# EAGLE design 89c2051-amiga1000-ps2 (EAGLE 4.16)
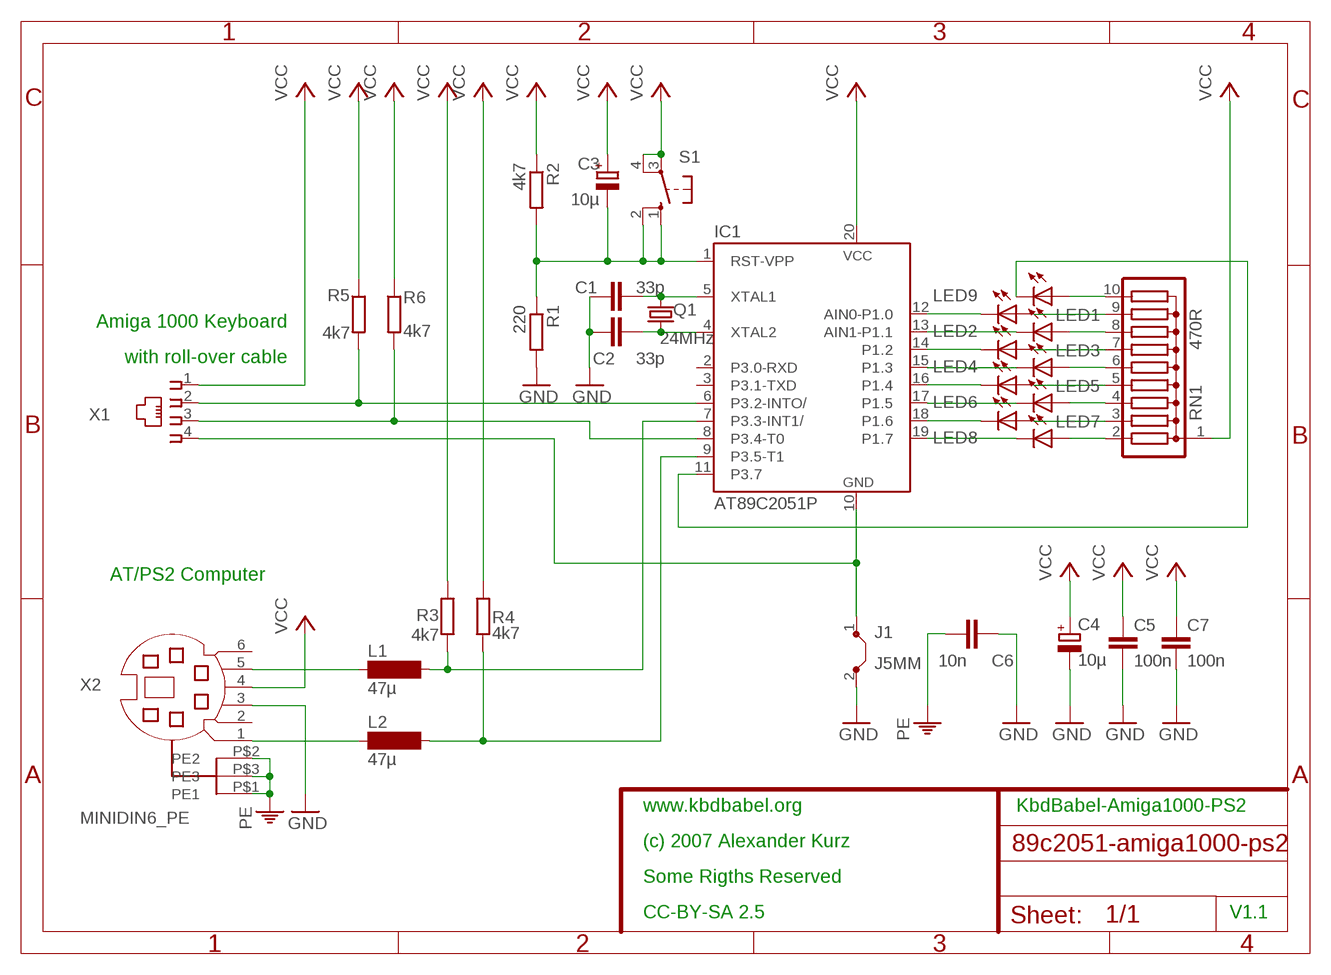
[diagram p0: schematic, sheet 1]

## Parts
C1  33p  C-EU025-030X050  [C025-030X050]
C2  33p  C-EU025-030X050  [C025-030X050]
C3  10µ  CPOL-EUE2-5  [E2-5]
C4  10µ  CPOL-EUE2-5  [E2-5]
C5  100n  C-EU025_050-025X075  [C025_050-025X075]
C6  10n  C-EU025_050-025X075  [C025_050-025X075]
C7  100n  C-EU025_050-025X075  [C025_050-025X075]
IC1  AT89C2051P  [DIL20]
J1  J5MM  [05]
L1  47µ  SD75  [SD75]
L2  47µ  SD75  [SD75]
LED1  LEDSQR2X5  [LED2X5]
LED2  LEDSQR2X5  [LED2X5]
LED3  LEDSQR2X5  [LED2X5]
LED4  LEDSQR2X5  [LED2X5]
LED5  LEDSQR2X5  [LED2X5]
LED6  LEDSQR2X5  [LED2X5]
LED7  LEDSQR2X5  [LED2X5]
LED8  LEDSQR2X5  [LED2X5]
LED9  LEDSQR2X5  [LED2X5]
Q1  24MHz  CRYSTALHC49U70  [HC49U70]
R1  220  R-EU_0204/7  [0204/7]
R2  4k7  R-EU_0204/7  [0204/7]
R3  4k7  R-EU_0204/7  [0204/7]
R4  4k7  R-EU_0204/7  [0204/7]
R5  4k7  R-EU_0204/7  [0204/7]
R6  4k7  R-EU_0204/7  [0204/7]
RN1  470R  G09R  [SIL10]
S1  10-XX  [B3F-10XX]
X1  520249-2  [520249-2]
X2  MINIDIN6_PE  [MINIDIN6_PE]

## Nets
GND: C1.1 C2.2 C4.- C5.1 C6.1 C7.1 J1.2 R1.2 X2.3
N$1: C1.2 IC1.5(XTAL1) Q1.2
N$2: C2.1 IC1.4(XTAL2) Q1.1
N$4: LED1.A RN1.9
N$5: IC1.17(P1.5) LED6.K(C)
N$6: L1.1 X2.5
N$7: IC1.6(P3.2-INTO/) R5.2 X1.2
N$8: IC1.12(AIN0-P1.0) LED1.K(C)
N$9: C3.- IC1.1(RST-VPP) R1.1 R2.2 S1.1(S) S1.2(S1)
N$10: IC1.8(P3.4-T0) R6.2 X1.3
N$11: IC1.10(GND) J1.1 X1.4
N$12: IC1.9(P3.5-T1) L2.2 R4.2
N$13: IC1.13(AIN1-P1.1) LED2.K(C)
N$14: LED3.A RN1.7
N$15: IC1.15(P1.3) LED4.K(C)
N$16: LED5.A RN1.5
N$17: LED2.A RN1.8
N$18: LED4.A RN1.6
N$19: LED6.A RN1.4
N$20: IC1.18(P1.6) LED7.K(C)
N$21: LED8.A RN1.2
N$22: LED7.A RN1.3
N$23: IC1.19(P1.7) LED8.K(C)
N$24: IC1.16(P1.4) LED5.K(C)
N$25: IC1.14(P1.2) LED3.K(C)
N$26: L2.1 X2.1
N$27: LED9.A RN1.10
N$28: IC1.11(P3.7) LED9.K(C)
N$30: IC1.7(P3.3-INT1/) L1.2 R3.2
PE: C6.2 X2.P$1(PE1) X2.P$2(PE2) X2.P$3(PE3)
VCC: C3.+ C4.+ C5.2 C7.2 IC1.20(VCC) R2.1 R3.1 R4.1 R5.1 R6.1 RN1.1 S1.3(P) S1.4(P1) X1.1 X2.4
Unconnected: IC1.2(P3.0-RXD) IC1.3(P3.1-TXD) X2.2 X2.6

## Notes on the sheet
- Amiga 1000 Keyboard
- with roll-over cable
- AT/PS2 Computer
- www.kbdbabel.org | KbdBabel-Amiga1000-PS2
- (c) 2007 Alexander Kurz
- Some Rigths Reserved
- CC-BY-SA 2.5 | V1.1

## Library data of the parts
C1 C2 C5-C7 = rcl:C-EU: CAPACITOR, European symbol
C3 C4 = rcl:CPOL-EU: POLARIZED CAPACITOR, European symbol
IC1 = atmel:AT89C2051: 80C31 MICROCONTROLLER 2 Kbytes FLASH 2.7 V
J1 = jumper:J: Bridge
L1 L2 = inductor-neosid:SD75: INDUCTOR nominal inductance, E12
LED1-LED9 = led:LED: LED OSRAM: - CHIPLED LG R971, LG N971, LY N971, LG Q971, LY Q971, LO R971, LY R971 LH N974, LH R974 LS Q976, LO Q976, LY Q976 LO Q996 - Hyper CHIPLED LW Q18S LB Q993, LB Q99A, LB R99A - SideLED LS A670, LO A670, LY A670, LG A670, LP A670 LB A673, LV A673, LT A673, LW A673 LH A674 LY A675 LS A676, LA A676, LO A676, LY A676, LW A676 LS A679, LY A679, LG A679 - Hyper Micro SIDELED® LS Y876, LA Y876, LO Y876, LY Y876 LT Y87S - SmartLED LW L88C, LW L88S LB L89C, LB L89S, LG L890 LS L89K, LO L89K, LY L89K LS L896, LA L896, LO L896, LY L896 - TOPLED LS T670, LO T670, LY T670, LG T670, LP T670 LSG T670, LSP T670, LSY T670, LOP T670, LYG T670 LG T671, LOG T671, LSG T671 LB T673, LV T673, LT T673, LW T673 LH T674 LS T676, LA T676, LO T676, LY T676, LB T676, LH T676, LSB T676, LW T676 LB T67C, LV T67C, LT T67C, LS T67K, LO T67K, LY T67K, LW E67C LS E67B, LA E67B, LO E67B, LY E67B, LB E67C, LV E67C, LT E67C LW T67C LS T679, LY T679, LG T679 LS T770, LO T770, LY T770, LG T770, LP T770 LB T773, LV T773, LT T773, LW T773 LH T774 LS E675, LA E675, LY E675, LS T675 LS T776, LA T776, LO T776, LY T776, LB T776 LHGB T686 LT T68C, LB T68C - Hyper Mini TOPLED® LB M676 - Mini TOPLED Santana® LG M470 LS M47K, LO M47K, LY M47K Source: http://www.osram.convergy.de - LUMILED® LXK2-PW12-R00, LXK2-PW12-S00, LXK2-PW14-U00, LXK2-PW14-V00 LXK2-PM12-R00, LXK2-PM12-S00, LXK2-PM14-U00 LXK2-PE12-Q00, LXK2-PE12-R00, LXK2-PE12-S00, LXK2-PE14-T00, LXK2-PE14-U00 LXK2-PB12-K00, LXK2-PB12-L00, LXK2-PB12-M00, LXK2-PB14-N00, LXK2-PB14-P00, LXK2-PB14-Q00 LXK2-PR12-L00, LXK2-PR12-M00, LXK2-PR14-Q00, LXK2-PR14-R00 LXK2-PD12-Q00, LXK2-PD12-R00, LXK2-PD12-S00 LXK2-PH12-R00, LXK2-PH12-S00 LXK2-PL12-P00, LXK2-PL12-Q00, LXK2-PL12-R00 Source: www.luxeon.com
Q1 = crystal:CRYSTAL: CRYSTAL
R1-R6 = rcl:R-EU_: RESISTOR, European symbol
RN1 = resistor-sil:G09R: SIL RESISTOR
S1 = switch-omron:10-XX: OMRON SWITCH
X1 = con-amp:520249-2: AMP connector
X2 = bla:MINIDIN6_PE

## Board
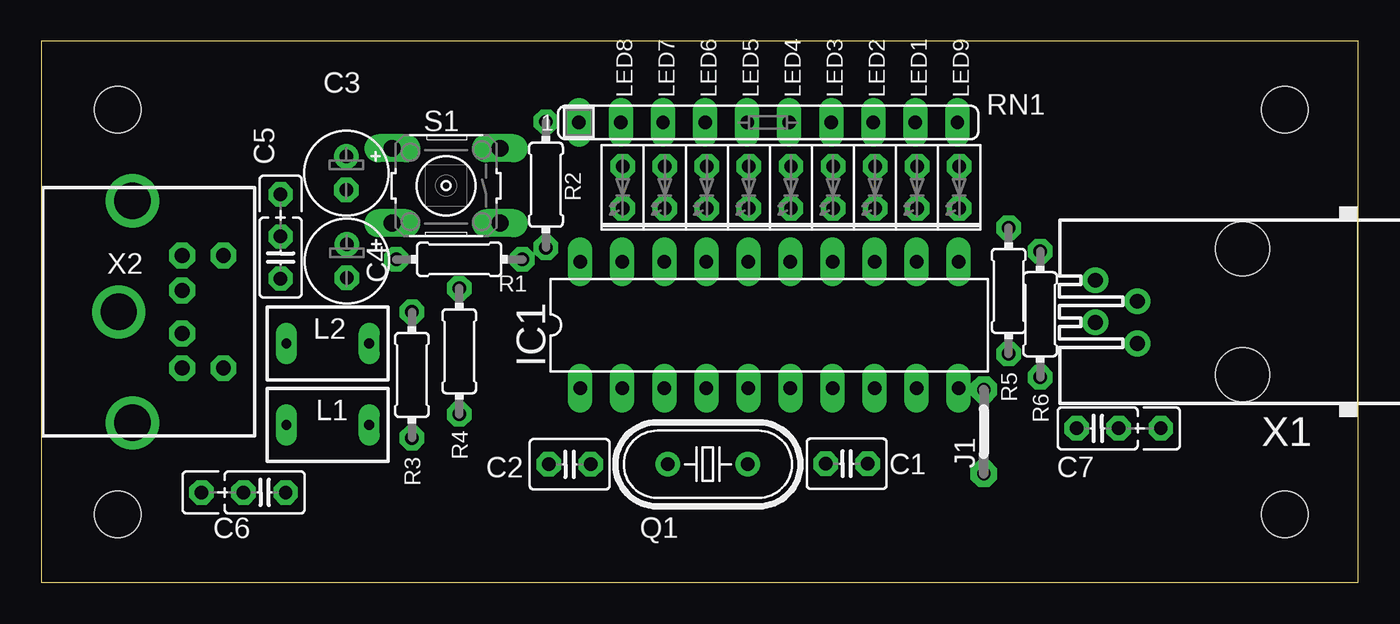
[diagram p1: board, top side]
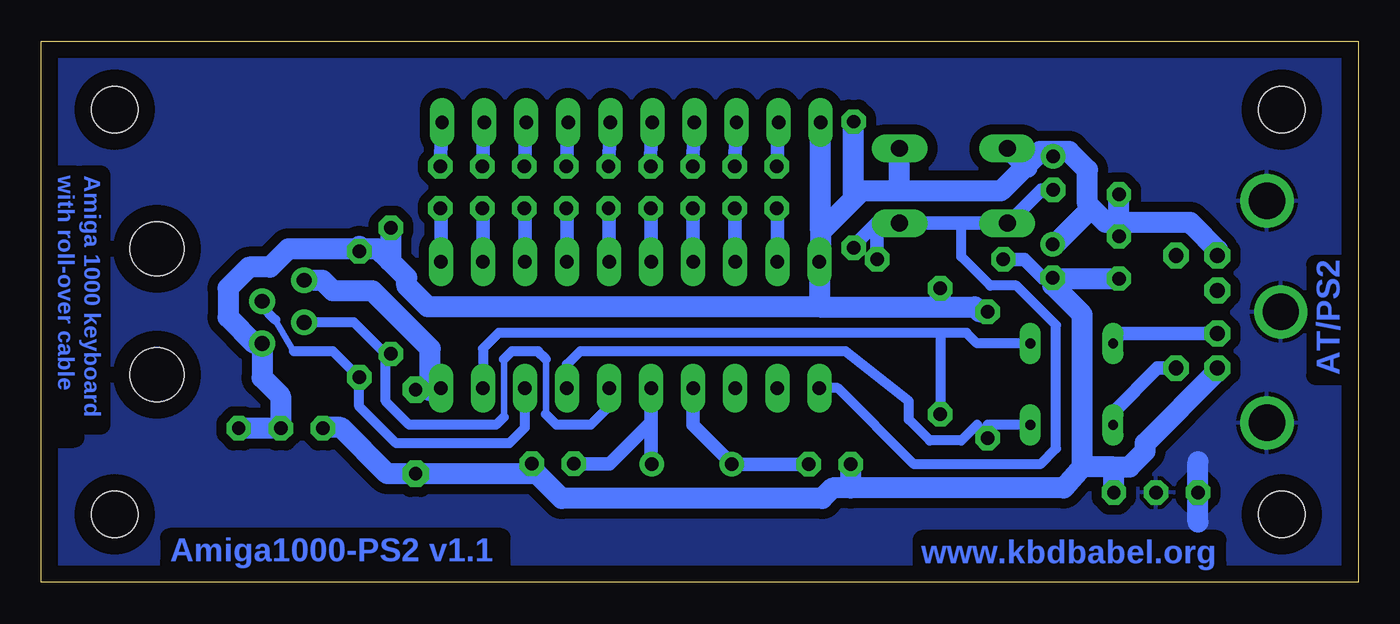
[diagram p2: board, bottom side, seen from below]

Size 79.52 x 32.69 mm. Coordinates in mm from the lower left corner, seen from the top.
Outline: 79.52,0 79.52,32.69 0,32.69 0,0 79.52,0
Copper layers (1*16): Top 0.035mm / dielectric 1.5mm / Bottom 0.035mm
Design rules "default": minimum track width 16mil, minimum drill 24mil, track to track 12mil, track to pad 12mil, pad to pad 16mil, via to via 16mil, smd to smd 16mil, copper to edge 40mil, drill to drill 8mil, minimum pad ring 13mil, minimum via ring 8mil, stop-mask expansion 4mil, vias tented up to drill 0mil, thermal gap 10mil
Holes 2.8 mm at 75.08,4.12 75.08,28.57 4.6,28.57 4.6,4.12

### Footprints (pad centres in the part's own frame; a part is rotated, then mirrored left to right if it is on the bottom)
C025-030X050 = drill 0.813 octagon: 1 -1.27,0; 2 1.27,0
E2-5 = drill 0.813 pad 1.27 round: + -1.016,0 | drill 0.813 pad 1.27 octagon: - 1.016,0
C025_050-025X075 = drill 0.813 octagon: 1 -1.27,0; 2 1.27,0; 3 3.81,0
DIL20 = drill 0.813 long: 1 -11.43,-3.81; 2 -8.89,-3.81; 3 -6.35,-3.81; 4 -3.81,-3.81; 5 -1.27,-3.81; 6 1.27,-3.81; 7 3.81,-3.81; 8 6.35,-3.81; 9 8.89,-3.81; 10 11.43,-3.81; 11 11.43,3.81; 12 8.89,3.81; 13 6.35,3.81; 14 3.81,3.81; 15 1.27,3.81; 16 -1.27,3.81; 17 -3.81,3.81; 18 -6.35,3.81; 19 -8.89,3.81; 20 -11.43,3.81
05 = drill 0.813 pad 1.6 octagon: 1 -2.54,0; 2 2.54,0
SD75 = drill 0.6 long: 1 -2.5,0; 2 2.5,0
LED2X5 = drill 0.813 octagon: A -1.27,0; K 1.27,0
HC49U70 = drill 0.813 round: 1 -2.413,0; 2 2.413,0
0204/7 = drill 0.813 octagon: 1 -3.81,0; 2 3.81,0
SIL10 = drill 0.813 long: 1 -11.43,0; 2 -8.89,0; 3 -6.35,0; 4 -3.81,0; 5 -1.27,0; 6 1.27,0; 7 3.81,0; 8 6.35,0; 9 8.89,0; 10 11.43,0
B3F-10XX = drill 1.016 long: 1 -3.251,2.261; 2 3.251,2.261; 3 -3.251,-2.261; 4 3.251,-2.261
520249-2 = drill 0.889 round: 1 -1.905,6.35; 2 -0.635,8.89; 3 0.635,6.35; 4 1.905,8.89 | hole 3.251: -3.81,0; 3.81,0
MINIDIN6_PE = drill 0.9 octagon: 1 1.3,2.15; 2 -1.3,2.15; 3 3.4,2.15; 4 -3.4,2.15; 5 3.4,4.65; 6 -3.4,4.65 | drill 2.2 round: P$1 0,-1.676; P$2 -6.706,-0.838; P$3 6.706,-0.838

### Placement (x,y rotation side)
C1  48.64,7.17 180 top
C2  31.9,7.14 180 top
C3  18.41,24.73 270 top
C4  18.44,19.42 270 top
C5  14.45,19.63 90 top
C6  13.48,5.44 180 top
C7  63.8,9.31 0 top
IC1  43.97,15.55 0 top
J1  56.92,9.11 270 top
L1  17.3,9.52 0 top
L2  17.3,14.44 0 top
LED1  52.89,23.87 270 top
LED2  50.35,23.87 270 top
LED3  47.81,23.87 270 top
LED4  45.27,23.87 270 top
LED5  42.73,23.87 270 top
LED6  40.19,23.87 270 top
LED7  37.65,23.87 270 top
LED8  35.11,23.87 270 top
LED9  55.43,23.87 270 top
Q1  40.25,7.14 0 top
R1  25.24,19.52 180 top
R2  30.47,24.03 270 top
R3  22.38,12.53 270 top
R4  25.24,13.96 270 top
R5  58.41,17.61 270 top
R6  60.32,16.2 270 top
RN1  43.89,27.79 0 top
S1  24.44,23.96 180 top
X1  72.54,16.34 90 top
X2  6.34,16.34 270 top

### Tracks (layer width: path | path; a pad name or v marks a point on that pad's centre or on a via)
GND
  Bottom 0.813: C4.- 19.04,18.4 20.16,19.52 21.58,19.52 R1.2
  Bottom 1.27: 16.66,6.98 17.77,5.71 30.63,5.71 | 16.66,6.98 16.66,16.19 18.44,17.96 C4.- 18.42,18.4 18.41,18.41 18.36,18.36 C5.1 | C7.1 62.53,9.35 62.54,9.36 61.43,9.36 58.64,6.57 J1.2 49.78,6.57 49.68,6.66 | 30.63,5.71 31.74,5.71 32.38,5.07 48.1,5.07 49.68,6.66 | C1.1 49.91,7.07 50,6.98 49.68,6.66 | 30.63,5.71 C2.2 | 30.63,5.71 | X2.3 8.49,12.77 12.85,8.41 12.85,7.93 13.81,6.98 14.76,6.98 | 14.76,6.98 16.66,6.98 | C6.1 14.75,6.97 14.76,6.98
N$1
  Bottom 0.813: Q1.2 42.7,7.14 42.7,9.68 | 42.7,9.68 IC1.5 | C1.2 45.21,7.17 42.7,9.68
N$2
  Bottom 0.813: 37.94,7.14 Q1.1 37.78,7.14 40.16,9.52 IC1.4 | C2.1 37.94,7.14 | 37.94,7.14
N$4
  Bottom 0.813: LED1.A RN1.9
N$5
  Bottom 0.813: LED6.K 40.19,22.66 40.16,22.69 IC1.17
N$6
  Bottom 0.813: X2.5 12.13,12.94 14.76,10.31 14.76,9.52 | 14.76,9.52 | 14.76,9.52 L1.1
N$7
  Bottom 0.406: 49.05,10.15 49.05,13.49 | 51.59,13.49 51.59,9.99
  Bottom 0.61: 49.05,10.15 48.41,9.52 46.35,9.52 45.24,10.63 IC1.6 | 49.05,13.49 49.52,13.96 51.11,13.96 51.59,13.49 | 51.59,9.99 52.06,9.52 57.3,9.52 58.73,10.95 58.73,13.49 | R5.2 | 58.73,13.49 R5.2 | 58.73,13.49 58.73,13.8 60.64,15.71 X1.2 | X1.2
N$8
  Bottom 0.813: LED1.K 52.89,22.66 52.86,22.69 IC1.12
N$9
  Bottom 0.61: 23.97,21.7 23.97,19.68 22.22,17.93 20.63,17.93 18.25,15.55 18.25,8.09 19.2,7.14 26.82,7.14 31.43,11.74 IC1.1
  Bottom 0.813: 21.19,21.66 21.27,21.58 | S1.2 21.19,21.66 | C3.- 19.14,23.71 21.19,21.66 | 27.74,21.7 S1.1 | 23.97,21.7 S1.2 | 23.97,21.7 27.74,21.7 | 27.74,21.7 27.78,21.74 | 30.57,20.22 30.63,20.15 | 30.57,20.22 R2.2 30.47,20.31 | 27.74,21.7 29.08,21.7 | 29.08,21.7 30.57,20.22 | S1.2 21.23,21.7 21.27,21.74 21.31,21.7 23.97,21.7 | 29.08,21.7 29.08,21.62 29.05,21.58 R1.1
N$10
  Bottom 0.406: 64.29,13.96 65.4,15.87
  Bottom 0.61: X1.3 66.19,16.66 65.4,15.87 | 64.29,13.96 61.91,13.96 60.32,12.38 | IC1.8 50.32,9.36 51.27,8.41 58.1,8.41 60.32,10.63 60.32,12.38 | 60.32,12.38 | 60.32,12.38 R6.2
N$11
  Bottom 1.27: 56.99,11.74 56.92,11.68 J1.1 | IC1.10 56.03,11.74 | 56.03,11.74 56.99,11.74 | 56.99,11.74 | X1.4 62.54,18.25 61.91,17.61 59.53,17.61 56.03,14.12 56.03,11.74 | 56.03,11.74 56.03,11.58
N$12
  Bottom 0.61: IC1.9 | IC1.9 52.86,14.12 51.91,15.07 25.24,15.07 | 25.24,15.07 23.65,15.07 23.01,14.44 19.84,14.44 | 19.84,14.44 | L2.2 19.84,14.44 | 25.24,15.07 R4.2 | 25.24,15.07
N$13
  Bottom 0.813: LED2.K 50.35,22.66 50.32,22.69 IC1.13
N$14
  Bottom 0.813: LED3.A RN1.7
N$15
  Bottom 0.813: LED4.K 45.33,22.6 45.4,22.54 45.24,22.38 IC1.15
N$16
  Bottom 0.813: LED5.A 42.7,26.95 RN1.5
N$17
  Bottom 0.813: LED2.A RN1.8
N$18
  Bottom 0.406: LED4.A RN1.6
  Bottom 0.813: LED4.A RN1.6
N$19
  Bottom 0.406: LED6.A RN1.4
  Bottom 0.813: LED6.A RN1.4
N$20
  Bottom 0.813: LED7.K 37.65,22.66 37.62,22.69 IC1.18
N$21
  Bottom 0.813: LED8.A RN1.2
N$22
  Bottom 0.813: LED7.A RN1.3
N$23
  Bottom 0.813: LED8.K 35.11,22.57 35.08,22.54 IC1.19
N$24
  Bottom 0.813: LED5.K 42.73,22.57 42.7,22.54 IC1.16
N$25
  Bottom 0.813: LED3.K 47.81,22.66 47.78,22.69 IC1.14
N$26
  Bottom 0.813: 14.92,14.44 | 14.92,14.44 L2.1 | X2.1 14.31,15.04 14.92,14.44
N$27
  Bottom 0.813: LED9.A RN1.10
N$28
  Bottom 0.813: LED9.K 55.43,22.66 55.4,22.69 IC1.11
N$30
  Bottom 0.61: 22.38,9.52 R3.2 23.01,9.52 23.97,8.57 25.87,8.57 27.14,9.84 27.14,10.95 30.95,13.96 46.98,13.96 47.78,13.17 47.78,11.9 47.94,11.74 | L1.2 22.38,9.52 | 22.38,9.52 | 47.94,11.74 | 47.94,11.74 IC1.7
PE
  Bottom 1.27: 9.68,3.64 9.68,7.3
  pour Bottom (isolate 0.61): 79.67,-0.13 79.64,32.85 -0.18,32.85 -0.14,-0.1
VCC
  Bottom 1.27: 18.41,25.71 | 18.41,25.71 C3.+ | 18.73,26.03 18.41,25.71 | 18.41,25.87 | C3.+ 18.41,25.87 | R3.1 22.85,16.34 23.15,16.64 25.24,16.64 | 25.24,16.64 25.24,16.82 | 25.24,16.82 R4.1 | 25.24,16.82 | 32.54,16.64 25.24,16.64 | IC1.20 32.54,16.64 | IC1.20 | 32.46,21.27 32.46,19.44 IC1.20 | 32.46,21.27 RN1.1 32.53,27.79 32.54,27.77 | 32.54,16.64 56.17,16.64 57.46,17.93 57.46,18.41 58.49,19.44 | 67.67,9.31 C7.2 65.07,9.35 65.08,9.36 65.08,11.26 66.19,12.38 X1.1 66.67,14.44 68.26,16.03 68.26,17.77 66.99,19.04 65.72,19.04 64.61,20.15 60.32,20.15 | X2.4 8.49,20.08 10,21.58 | 10,21.58 | 10,21.58 10.15,21.74 14.44,21.74 | 14.44,21.74 15.23,21.74 16.11,22.62 | 16.11,22.62 16.35,22.85 16.35,24.92 17.46,26.03 18.73,26.03 | 18.73,26.03 18.44,25.74 C3.+ | 14.44,23.49 14.45,23.48 C5.2 14.45,21.1 14.44,21.11 14.44,21.74 | 16.11,22.62 | C4.+ 18.29,20.43 16.11,22.62 | 18.73,26.03 19.2,26.03 20.08,25.16 | 20.08,25.16 21.58,23.65 27.62,23.65 | 32.46,21.27 32.38,21.27 30.47,23.17 | 27.62,23.65 30,23.65 30.4,23.25 | 30.4,23.25 30.47,23.17 | 30.4,23.25 30.47,23.33 | 27.62,23.65 27.62,23.81 27.69,23.88 S1.3 | 20.08,25.16 20,25.08 | S1.4 21.15,26.23 20.08,25.16 | 60.32,20.15 59.21,20.15 58.49,19.44 | 60.32,20.15 60.32,20.31 | 60.32,20.31 R6.1 | 60.32,20.31 | 58.49,19.44 58.41,19.52 R5.1 | 30.47,23.17 R2.1

### Text on the board
Bottom: Amiga 1000 keyboard | with roll-over cable | AT/PS2 | www.kbdbabel.org | Amiga1000-PS2 v1.1